# EAGLE schematic MSP430_REV1_5_21_19_NEW1 (EAGLE 9.3.1)

## Sheet 1 of 2
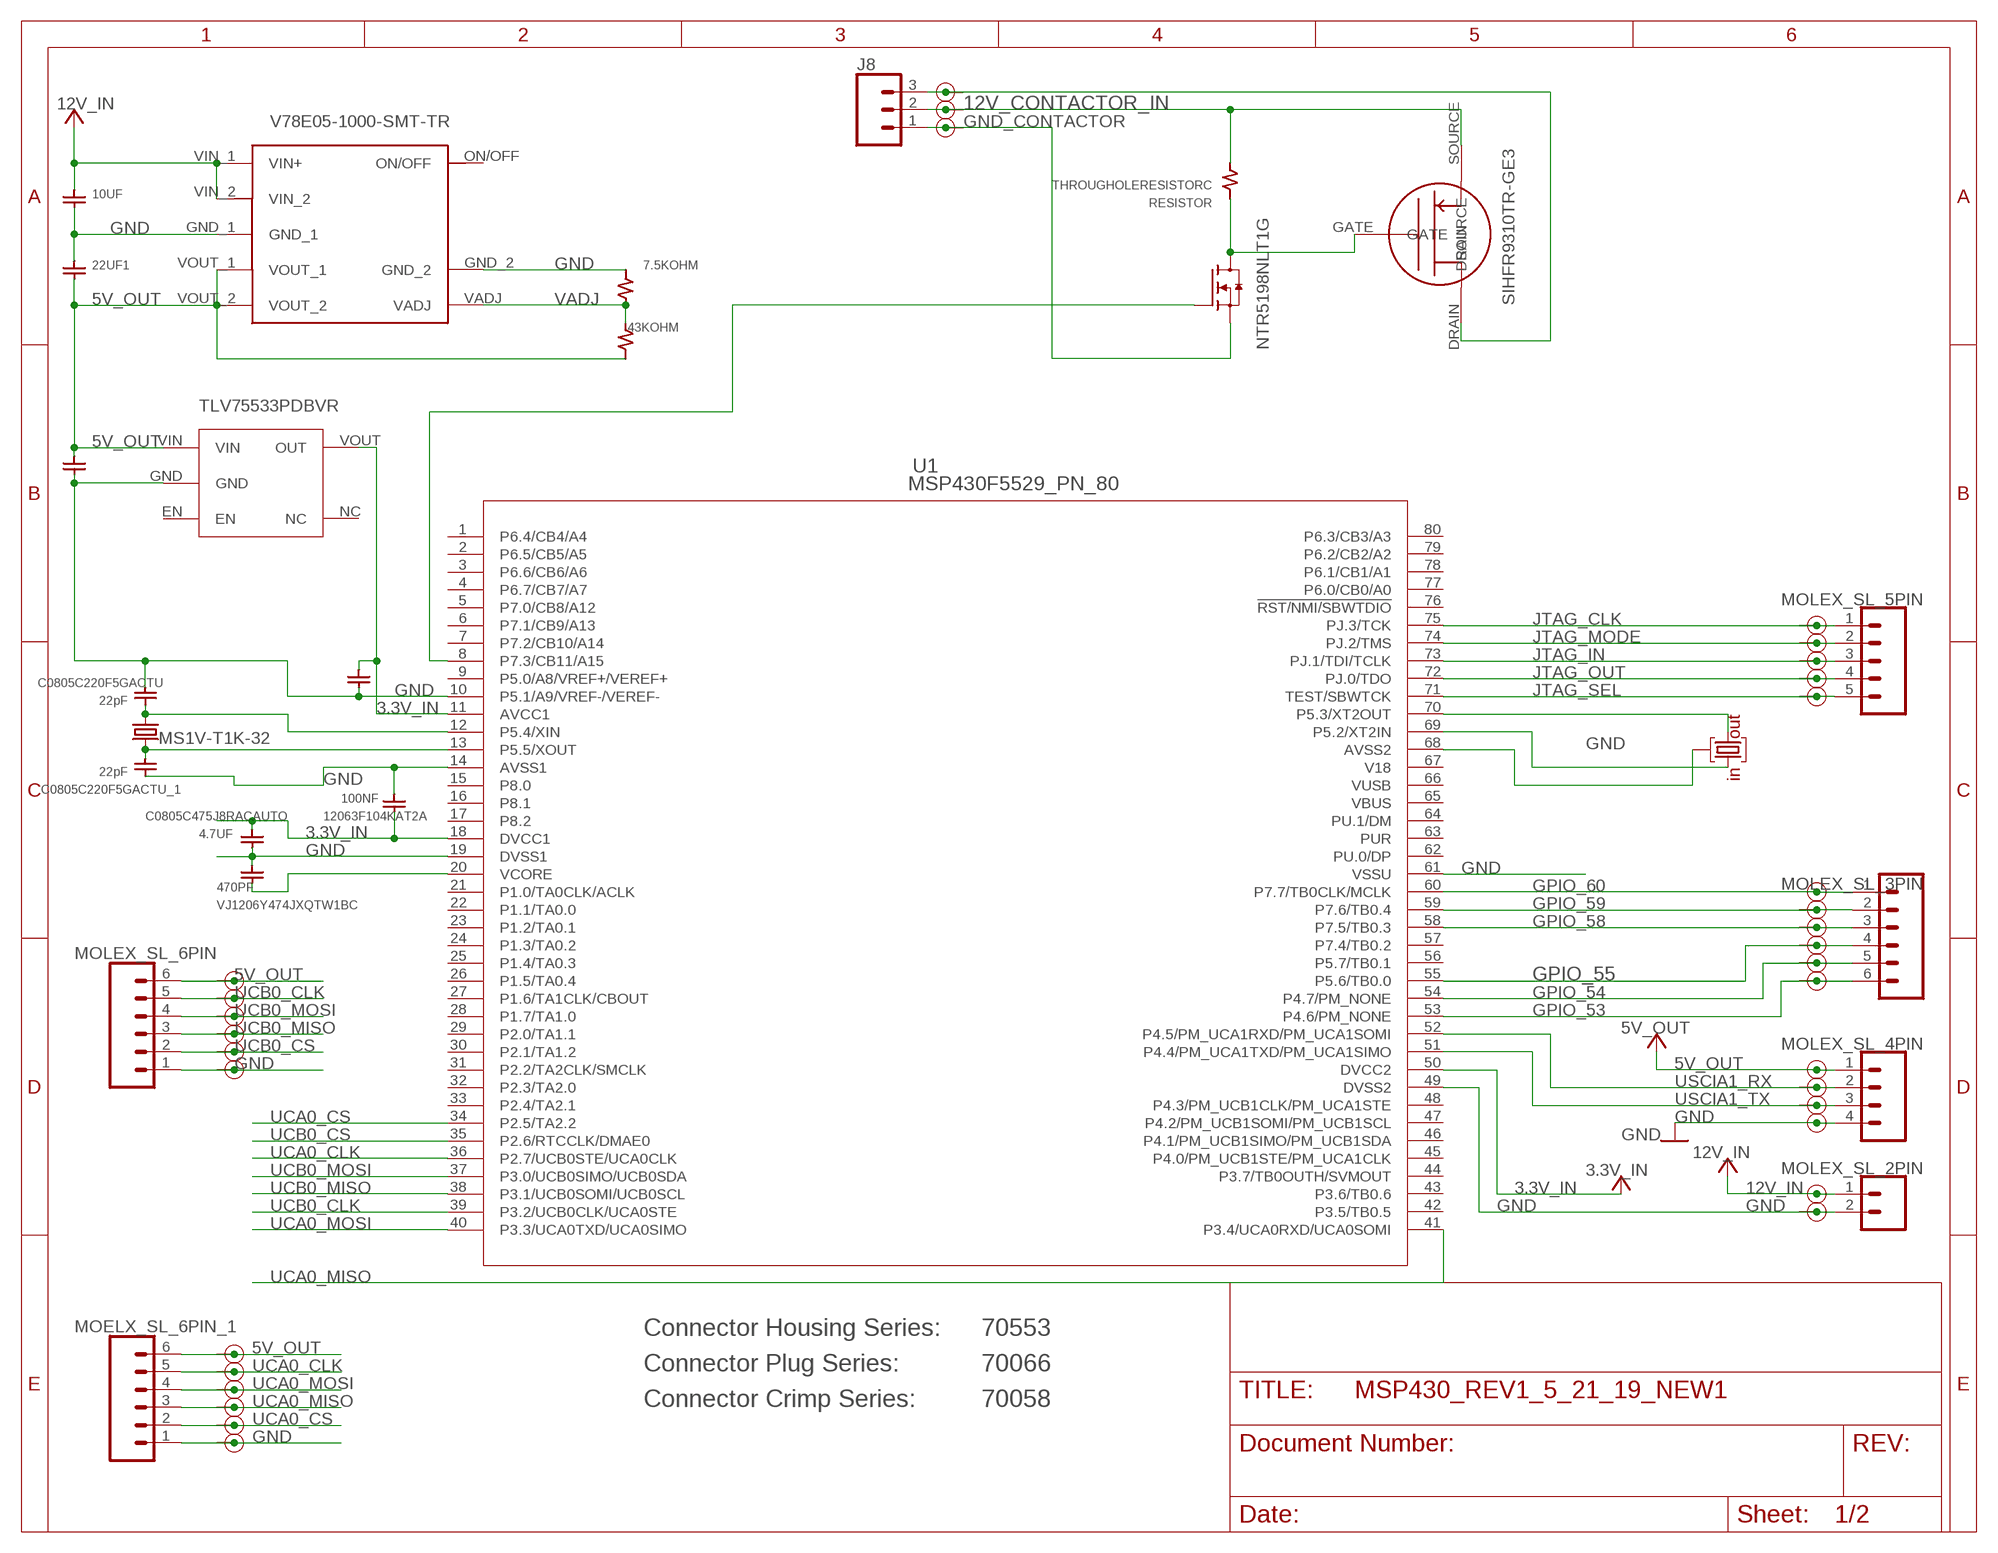
[diagram p0: schematic, sheet 1]

### Parts
4.7UF  C0805C475J8RACAUTO  [C0805C475J8RACAUTO]
7.5KOHM  RC2512FK-077K5L  [RC2512FK-077K5L]
10UF  GRT31CR61H106KE01L  [GRT31CR61H106KE01L]
22UF1  GRT31CC81C226KE01L  [GRT31CC81C226KE01L]
43KOHM  CRCW121043K0FKEAHP  [CRCW121043K0FKEAHP]
100NF  12063F104KAT2A  [12063F104KAT2A]
470PF  VJ1206Y474JXQTW1BC  [VJ1206Y474JXQTW1BC]
C0805C220F5GACTU  22pF  C0805C220F5GACTUC0805C220F5GACTU  [C0805C220F5GACTU]
C0805C220F5GACTU_1  22pF  C0805C220F5GACTUC0805C220F5GACTU  [C0805C220F5GACTU]
J8  CONN_03  [1X03]
MOELX_SL_6PIN_1  CONN_06SILK_FEMALE_PTH  [1X06]
MOLEX_SL_2PIN  CONN_02  [1X02]
MOLEX_SL_3PIN  CONN_06SILK_FEMALE_PTH  [1X06]
MOLEX_SL_4PIN  CONN_04  [1X04]
MOLEX_SL_5PIN  CONN_05  [1X05]
MOLEX_SL_6PIN  CONN_06SILK_FEMALE_PTH  [1X06]
RESISTOR  THROUGHOLERESISTORC  THROUGHOLERESISTORCMF6023K000DHR6  [THROUGHHOLERESISTOR]
U1  MSP430F5529_PN_80  [PN80]
U$1  MS1V-T1K-32  [MS1V-T1K]
U$2  CSTCR4M00G53U-R0  [CSTCR4M00G53U-R0]
U$3  V78E05-SMT-TR  [V78E05-1000-SMT-TR]
U$4  NTR5198NLT1G  [NTR5198NLT1G]
U$5  PMOS  [SIHFR9310TR-GE3]
U$6  TLV75533PDBVR  [TLV75533PDBVR]
U$7  C0805C105J4RECTU  [C0805C105J4RECTU]
U$8  C0805C105J4RECTU  [C0805C105J4RECTU]
U$10  HEADER_PIN_2.15/1.0  [2,15/1,0]
U$11  HEADER_PIN_2.15/1.0  [2,15/1,0]
U$12  HEADER_PIN_2.15/1.0  [2,15/1,0]
U$13  HEADER_PIN_2.15/1.0  [2,15/1,0]
U$14  HEADER_PIN_2.15/1.0  [2,15/1,0]
U$15  HEADER_PIN_2.15/1.0  [2,15/1,0]
U$16  HEADER_PIN_2.15/1.0  [2,15/1,0]
U$17  HEADER_PIN_2.15/1.0  [2,15/1,0]
U$18  HEADER_PIN_2.15/1.0  [2,15/1,0]
U$19  HEADER_PIN_2.15/1.0  [2,15/1,0]
U$20  HEADER_PIN_2.15/1.0  [2,15/1,0]
U$21  HEADER_PIN_2.15/1.0  [2,15/1,0]
U$22  HEADER_PIN_2.15/1.0  [2,15/1,0]
U$23  HEADER_PIN_2.15/1.0  [2,15/1,0]
U$24  HEADER_PIN_2.15/1.0  [2,15/1,0]
U$25  HEADER_PIN_2.15/1.0  [2,15/1,0]
U$26  HEADER_PIN_2.15/1.0  [2,15/1,0]
U$27  HEADER_PIN_2.15/1.0  [2,15/1,0]
U$28  HEADER_PIN_2.15/1.0  [2,15/1,0]
U$29  HEADER_PIN_2.15/1.0  [2,15/1,0]
U$30  HEADER_PIN_2.15/1.0  [2,15/1,0]
U$31  HEADER_PIN_2.15/1.0  [2,15/1,0]
U$32  HEADER_PIN_2.15/1.0  [2,15/1,0]
U$33  HEADER_PIN_2.15/1.0  [2,15/1,0]
U$34  HEADER_PIN_2.15/1.0  [2,15/1,0]
U$35  HEADER_PIN_2.15/1.0  [2,15/1,0]
U$36  HEADER_PIN_2.15/1.0  [2,15/1,0]
U$37  HEADER_PIN_2.15/1.0  [2,15/1,0]
U$38  HEADER_PIN_2.15/1.0  [2,15/1,0]
U$39  HEADER_PIN_2.15/1.0  [2,15/1,0]
U$40  HEADER_PIN_2.15/1.0  [2,15/1,0]
U$41  HEADER_PIN_2.15/1.0  [2,15/1,0]

### Nets
3.3V_IN: 4.7UF.2 100NF.1 U1.11(AVCC1) U1.18(DVCC1) U1.50(DVCC2) U$6.VOUT(OUT) U$8.2
5V_OUT: 22UF1.1 43KOHM.2 MOELX_SL_6PIN_1.6 MOLEX_SL_4PIN.1 MOLEX_SL_6PIN.6 U$3.VOUT_1 U$3.VOUT_2 U$6.VIN U$7.2 U$11.1 U$17.1 U$27.1
12V_CONTACTOR_IN: J8.2 RESISTOR.1 U$5.SOURCE U$40.1
12V_IN: 10UF.2 MOLEX_SL_2PIN.1 U$3.VIN_1(VIN+) U$3.VIN_2 U$23.1
GND: 4.7UF.1 7.5KOHM.2 10UF.1 22UF1.2 100NF.2 470PF.2 C0805C220F5GACTU.1 C0805C220F5GACTU_1.2 MOELX_SL_6PIN_1.1 MOLEX_SL_2PIN.2 MOLEX_SL_4PIN.4 MOLEX_SL_6PIN.1 U1.10(P5.1/A9/VREF-/VEREF-) U1.14(AVSS1) U1.19(DVSS1) U1.49(DVSS2) U1.61(VSSU) U1.68(AVSS2) U$2.GND U$3.GND_1 U$3.GND_2 U$6.GND U$7.1 U$8.1 U$10.1 U$16.1 U$22.1 U$24.1 ; also sheet 2
GND_CONTACTOR: J8.1 U$4.SOURCE U$41.1
GPIO_53: MOLEX_SL_3PIN.6 U1.53(P4.6/PM_NONE) U$28.1
GPIO_54: MOLEX_SL_3PIN.5 U1.54(P4.7/PM_NONE) U$29.1
GPIO_55: MOLEX_SL_3PIN.4 U1.55(P5.6/TB0.0) U$30.1
GPIO_58: MOLEX_SL_3PIN.3 U1.58(P7.5/TB0.3) U$31.1
GPIO_59: MOLEX_SL_3PIN.2 U1.59(P7.6/TB0.4) U$32.1
GPIO_60: MOLEX_SL_3PIN.1 U1.60(P7.7/TB0CLK/MCLK) U$33.1
JTAG_CLK: MOLEX_SL_5PIN.1 U1.75(PJ.3/TCK) U$38.1
JTAG_IN: MOLEX_SL_5PIN.3 U1.73(PJ.1/TDI/TCLK) U$36.1
JTAG_MODE: MOLEX_SL_5PIN.2 U1.74(PJ.2/TMS) U$37.1
JTAG_OUT: MOLEX_SL_5PIN.4 U1.72(PJ.0/TDO) U$35.1
JTAG_SEL: MOLEX_SL_5PIN.5 U1.71(TEST/SBWTCK) U$34.1
N$1: 470PF.1 U1.20(VCORE)
N$2: J8.3 U$5.DRAIN U$39.1
N$12: U1.69(P5.2/XT2IN) U$2.IN
N$13: U1.70(P5.3/XT2OUT) U$2.OUT
N$19: C0805C220F5GACTU.2 U1.12(P5.4/XIN) U$1.P$2
N$20: C0805C220F5GACTU_1.1 U1.13(P5.5/XOUT) U$1.P$3
N$30: RESISTOR.2 U$4.DRAIN U$5.GATE
N$31: U1.8(P7.3/CB11/A15) U$4.GATE
UCA0_CLK: MOELX_SL_6PIN_1.5 U1.36(P2.7/UCB0STE/UCA0CLK) U$18.1
UCA0_CS: MOELX_SL_6PIN_1.2 U1.34(P2.5/TA2.2) U$21.1
UCA0_MISO: MOELX_SL_6PIN_1.3 U1.41(P3.4/UCA0RXD/UCA0SOMI) U$20.1
UCA0_MOSI: MOELX_SL_6PIN_1.4 U1.40(P3.3/UCA0TXD/UCA0SIMO) U$19.1
UCB0_CLK: MOLEX_SL_6PIN.5 U1.39(P3.2/UCB0CLK/UCA0STE) U$12.1
UCB0_CS: MOLEX_SL_6PIN.2 U1.35(P2.6/RTCCLK/DMAE0) U$15.1
UCB0_MISO: MOLEX_SL_6PIN.3 U1.38(P3.1/UCB0SOMI/UCB0SCL) U$14.1
UCB0_MOSI: MOLEX_SL_6PIN.4 U1.37(P3.0/UCB0SIMO/UCB0SDA) U$13.1
USCIA1_RX: MOLEX_SL_4PIN.2 U1.52(P4.5/PM_UCA1RXD/PM_UCA1SOMI) U$26.1
USCIA1_TX: MOLEX_SL_4PIN.3 U1.51(P4.4/PM_UCA1TXD/PM_UCA1SIMO) U$25.1
VADJ: 7.5KOHM.1 43KOHM.1 U$3.VADJ
Unconnected: U1.1(P6.4/CB4/A4) U1.2(P6.5/CB5/A5) U1.3(P6.6/CB6/A6) U1.4(P6.7/CB7/A7) U1.5(P7.0/CB8/A12) U1.6(P7.1/CB9/A13) U1.7(P7.2/CB10/A14) U1.9(P5.0/A8/VREF+/VEREF+) U1.15(P8.0) U1.16(P8.1) U1.17(P8.2) U1.21(P1.0/TA0CLK/ACLK) U1.22(P1.1/TA0.0) U1.23(P1.2/TA0.1) U1.24(P1.3/TA0.2) U1.25(P1.4/TA0.3) U1.26(P1.5/TA0.4) U1.27(P1.6/TA1CLK/CBOUT) U1.28(P1.7/TA1.0) U1.29(P2.0/TA1.1) U1.30(P2.1/TA1.2) U1.31(P2.2/TA2CLK/SMCLK) U1.32(P2.3/TA2.0) U1.33(P2.4/TA2.1) U1.42(P3.5/TB0.5) U1.43(P3.6/TB0.6) U1.44(P3.7/TB0OUTH/SVMOUT) U1.45(P4.0/PM_UCB1STE/PM_UCA1CLK) U1.46(P4.1/PM_UCB1SIMO/PM_UCB1SDA) U1.47(P4.2/PM_UCB1SOMI/PM_UCB1SCL) U1.48(P4.3/PM_UCB1CLK/PM_UCA1STE) U1.56(P5.7/TB0.1) U1.57(P7.4/TB0.2) U1.62(PU.0/DP) U1.63(PUR) U1.64(PU.1/DM) U1.76(!RST/NMI/SBWTDIO) U1.77(P6.0/CB0/A0) U1.78(P6.1/CB1/A1) U1.79(P6.2/CB2/A2) U1.80(P6.3/CB3/A3) U$3.ON/OFF U$6.EN U$6.NC

### Notes on the sheet
- Connector Housing Series: | 70553
- Connector Plug Series: | 70066
- Connector Crimp Series: | 70058

## Sheet 2 of 2
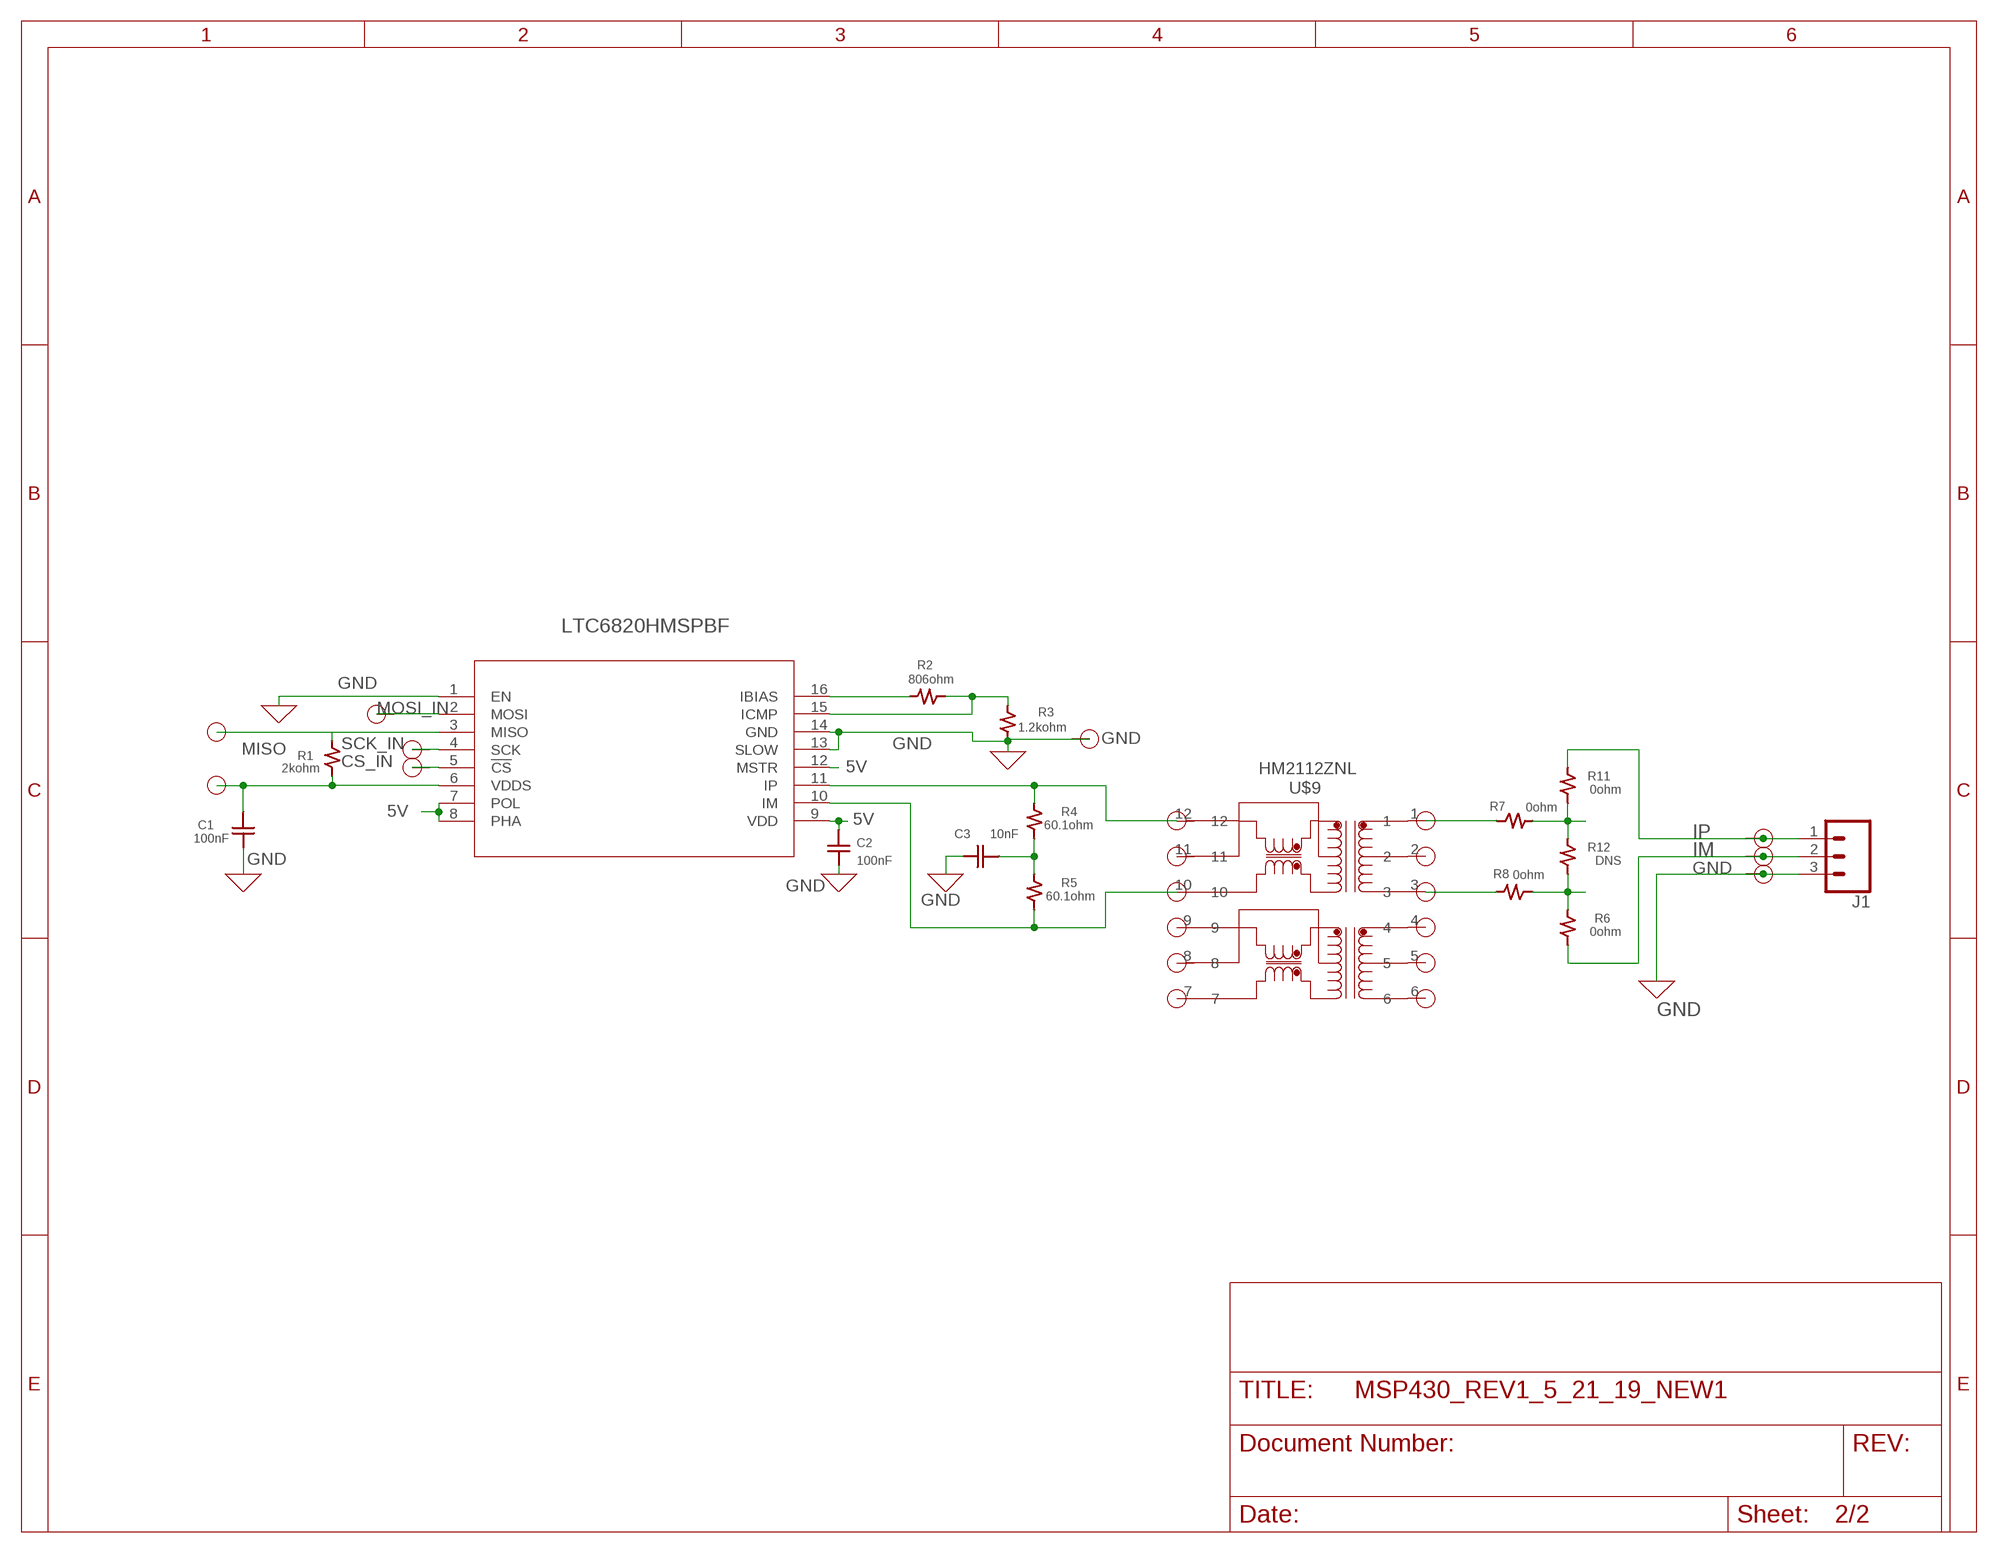
[diagram p1: schematic, sheet 2]

### Parts
C1  100nF  0805_CAPACITOR  [0805_CAPACITOR]
C2  100nF  0805_CAPACITOR  [0805_CAPACITOR]
C3  10nF  0805_CAPACITOR  [0805_CAPACITOR]
CS  HEADER_PIN_2.15/1.0  [2,15/1,0]
GND  HEADER_PIN_2.15/1.0  [2,15/1,0]
J1  CONN_03  [1X03]
MISO  HEADER_PIN_2.15/1.0  [2,15/1,0]
MOSI  HEADER_PIN_2.15/1.0  [2,15/1,0]
R1  2kohm  0805_RESISTOR  [0805_RESISTOR]
R2  806ohm  0805_RESISTOR  [0805_RESISTOR]
R3  1.2kohm  0805_RESISTOR  [0805_RESISTOR]
R4  60.1ohm  0805_RESISTOR  [0805_RESISTOR]
R5  60.1ohm  0805_RESISTOR  [0805_RESISTOR]
R6  0ohm  0805_RESISTOR  [0805_RESISTOR]
R7  0ohm  0805_RESISTOR  [0805_RESISTOR]
R8  0ohm  0805_RESISTOR  [0805_RESISTOR]
R11  0ohm  0805_RESISTOR  [0805_RESISTOR]
R12  DNS  0805_RESISTOR  [0805_RESISTOR]
SCK  HEADER_PIN_2.15/1.0  [2,15/1,0]
U2  LTC6820HMSPBF  [MSOP-16_MS]
U$9  HM2112ZNL  [HM2112ZNL_12SMT]
U$42  HEADER_PIN_2.15/1.0  [2,15/1,0]
U$43  HEADER_PIN_2.15/1.0  [2,15/1,0]
U$44  HEADER_PIN_2.15/1.0  [2,15/1,0]
VDDS  HEADER_PIN_2.15/1.0  [2,15/1,0]

### Nets
5V: C1.P$2 C2.P$2 R1.P$2 U2.6(VDDS) U2.7(POL) U2.8(PHA) U2.9(VDD) U2.12(MSTR) VDDS.1
CS_IN: CS.1 U2.5(!CS)
GND: C1.P$1 C2.P$1 C3.P$1 GND.1 J1.3 R3.P$2 U2.1(EN) U2.13(SLOW) U2.14(GND) U$44.1 ; also sheet 1
IBIAS: R2.P$1 U2.16(IBIAS)
ICMP: R2.P$2 R3.P$1 U2.15(ICMP)
IM: J1.2 R5.P$2 R6.P$2 U2.10(IM) U$9.10 U$43.1
IP: J1.1 R4.P$1 R11.P$1 U2.11(IP) U$9.12 U$42.1
MISO_IN: MISO.1 R1.P$1 U2.3(MISO)
MOSI_IN: MOSI.1 U2.2(MOSI)
N$3: C3.P$2 R4.P$2 R5.P$1
N$11: R8.P$1 U$9.3
N$21: R7.P$2 U$9.1
N$40: R6.P$1 R8.P$2 R12.P$2
N$41: R7.P$1 R11.P$2 R12.P$1
SCK_IN: SCK.1 U2.4(SCK)
Unconnected: U$9.2 U$9.4 U$9.5 U$9.6 U$9.7 U$9.8 U$9.9 U$9.11

## Power pins joined to a net without a drawn wire
V18: U1.67(V18)
VBUS: U1.65(VBUS)
VUSB: U1.66(VUSB)

## Library data of the parts
4.7UF = Library_Capstone:C0805C475J8RACAUTO
7.5KOHM = Library_Capstone:RC2512FK-077K5L
10UF = Library_Capstone:GRT31CR61H106KE01L
22UF1 = Library_Capstone:GRT31CC81C226KE01L
43KOHM = Library_Capstone:CRCW121043K0FKEAHP
100NF = Library_Capstone:12063F104KAT2A
470PF = Library_Capstone:VJ1206Y474JXQTW1BC
C1-C3 = Library_Capstone:0805_CAPACITOR; MPN: MC0805B104K160CT; OC_NEWARK: 06R3738
C0805C220F5GACTU C0805C220F5GACTU_1 = Library_Capstone:C0805C220F5GACTU
CS GND MISO MOSI SCK U$10-U$44 VDDS = Library_Capstone:HEADER_PIN_2.15/1.0
J1 J8 = SparkFun-Connectors:CONN_03: Multi connection point. Often used as Generic Header-pin footprint for 0.1 inch spaced/style header connections On any of the 0.1 inch spaced packages, you can populate with these: Break Away Headers - Straight <https://www.sparkfun.com/products/116> (PRT-00116) Break Away Male Headers - Right Angle <https://www.sparkfun.com/products/553> (PRT-00553) Female Headers <https://www.sparkfun.com/products/115> (PRT-00115) Break Away Headers - Machine Pin <https://www.sparkfun.com/products/117> (PRT-00117) Break Away Female Headers - Swiss Machine Pin <https://www.sparkfun.com/products/743> (PRT-00743) Stackable Header - 3 Pin (Female, 0.1") <https://www.sparkfun.com/products/13875> (PRT-13875) For SCREWTERMINALS and SPRING TERMINALS visit here: Screw Terimnals on SparkFun.com <https://www.sparkfun.com/search/results?term=Screw+Terminals> (5mm/3.5mm/2.54mm spacing) This device is also useful as a general connection point to wire up your design to another part of your project. Our various solder wires solder well into these plated through hole pads. Hook-Up Wire - Assortment (Stranded, 22 AWG) <https://www.sparkfun.com/products/11375> (PRT-11375) Hook-Up Wire - Assortment (Solid Core, 22 AWG) <https://www.sparkfun.com/products/11367> (PRT-11367) View the entire wire category on our website here <https://www.sparkfun.com/categories/141> Special notes: Molex polarized connector foot print use with SKU : PRT-08232 with associated crimp pins and housings.
MOELX_SL_6PIN_1 MOLEX_SL_3PIN MOLEX_SL_6PIN = SparkFun-Connectors:CONN_06: Multi connection point. Often used as Generic Header-pin footprint for 0.1 inch spaced/style header connections On any of the 0.1 inch spaced packages, you can populate with these: Break Away Headers - Straight <https://www.sparkfun.com/products/116> (PRT-00116) Break Away Male Headers - Right Angle <https://www.sparkfun.com/products/553> (PRT-00553) Female Headers <https://www.sparkfun.com/products/115> (PRT-00115) Break Away Headers - Machine Pin <https://www.sparkfun.com/products/117> (PRT-00117) Break Away Female Headers - Swiss Machine Pin <https://www.sparkfun.com/products/743> (PRT-00743) Arduino Stackable Header - 6 Pin <https://www.sparkfun.com/products/9280> (PRT-09280) For SCREWTERMINALS and SPRING TERMINALS visit here: Screw Terimnals on SparkFun.com <https://www.sparkfun.com/search/results?term=Screw+Terminals> (5mm/3.5mm/2.54mm spacing) This device is also useful as a general connection point to wire up your design to another part of your project. Our various solder wires solder well into these plated through hole pads. Hook-Up Wire - Assortment (Stranded, 22 AWG) <https://www.sparkfun.com/products/11375> (PRT-11375) Hook-Up Wire - Assortment (Solid Core, 22 AWG) <https://www.sparkfun.com/products/11367> (PRT-11367) View the entire wire category on our website here <https://www.sparkfun.com/categories/141>; PROD_ID: CONN-08437
MOLEX_SL_2PIN = SparkFun-Connectors:CONN_02: Multi connection point. Often used as Generic Header-pin footprint for 0.1 inch spaced/style header connections On any of the 0.1 inch spaced packages, you can populate with these: Break Away Headers - Straight <https://www.sparkfun.com/products/116> (PRT-00116) Break Away Male Headers - Right Angle <https://www.sparkfun.com/products/553> (PRT-00553) Female Headers <https://www.sparkfun.com/products/115> (PRT-00115) Break Away Headers - Machine Pin <https://www.sparkfun.com/products/117> (PRT-00117) Break Away Female Headers - Swiss Machine Pin <https://www.sparkfun.com/products/743> (PRT-00743) For SCREWTERMINALS and SPRING TERMINALS visit here: Screw Terimnals on SparkFun.com <https://www.sparkfun.com/search/results?term=Screw+Terminals> (5mm/3.5mm/2.54mm spacing) This device is also useful as a general connection point to wire up your design to another part of your project. Our various solder wires solder well into these plated through hole pads. Hook-Up Wire - Assortment (Stranded, 22 AWG) <https://www.sparkfun.com/products/11375> (PRT-11375) Hook-Up Wire - Assortment (Solid Core, 22 AWG) <https://www.sparkfun.com/products/11367> (PRT-11367) View the entire wire category on our website here <https://www.sparkfun.com/categories/141> Special notes: Molex polarized connector foot print use with: PRT-08233 with associated crimp pins and housings. 2.54_SCREWTERM for use with PRT-10571. 3.5mm Screw Terminal footprints for PRT-08084 5mm Screw Terminal footprints for use with PRT-08432
MOLEX_SL_4PIN = SparkFun-Connectors:CONN_04: Multi connection point. Often used as Generic Header-pin footprint for 0.1 inch spaced/style header connections On any of the 0.1 inch spaced packages, you can populate with these: Break Away Headers - Straight <https://www.sparkfun.com/products/116> (PRT-00116) Break Away Male Headers - Right Angle <https://www.sparkfun.com/products/553> (PRT-00553) Female Headers <https://www.sparkfun.com/products/115> (PRT-00115) Break Away Headers - Machine Pin <https://www.sparkfun.com/products/117> (PRT-00117) Break Away Female Headers - Swiss Machine Pin <https://www.sparkfun.com/products/743> (PRT-00743) For SCREWTERMINALS and SPRING TERMINALS visit here: Screw Terimnals on SparkFun.com <https://www.sparkfun.com/search/results?term=Screw+Terminals> (5mm/3.5mm/2.54mm spacing) This device is also useful as a general connection point to wire up your design to another part of your project. Our various solder wires solder well into these plated through hole pads. Hook-Up Wire - Assortment (Stranded, 22 AWG) <https://www.sparkfun.com/products/11375> (PRT-11375) Hook-Up Wire - Assortment (Solid Core, 22 AWG) <https://www.sparkfun.com/products/11367> (PRT-11367) View the entire wire category on our website here <https://www.sparkfun.com/categories/141> Special notes: Molex polarized connector foot print use with SKU : PRT-08231 with associated crimp pins and housings. 1MM SMD Version SKU: PRT-10208; PROD_ID: CONN-09696
MOLEX_SL_5PIN = SparkFun-Connectors:CONN_05: Multi connection point. Often used as Generic Header-pin footprint for 0.1 inch spaced/style header connections On any of the 0.1 inch spaced packages, you can populate with these: Break Away Headers - Straight <https://www.sparkfun.com/products/116> (PRT-00116) Break Away Male Headers - Right Angle <https://www.sparkfun.com/products/553> (PRT-00553) Female Headers <https://www.sparkfun.com/products/115> (PRT-00115) Break Away Headers - Machine Pin <https://www.sparkfun.com/products/117> (PRT-00117) Break Away Female Headers - Swiss Machine Pin <https://www.sparkfun.com/products/743> (PRT-00743) For SCREWTERMINALS and SPRING TERMINALS visit here: Screw Terimnals on SparkFun.com <https://www.sparkfun.com/search/results?term=Screw+Terminals> (5mm/3.5mm/2.54mm spacing) This device is also useful as a general connection point to wire up your design to another part of your project. Our various solder wires solder well into these plated through hole pads. Hook-Up Wire - Assortment (Stranded, 22 AWG) <https://www.sparkfun.com/products/11375> (PRT-11375) Hook-Up Wire - Assortment (Solid Core, 22 AWG) <https://www.sparkfun.com/products/11367> (PRT-11367) View the entire wire category on our website here <https://www.sparkfun.com/categories/141> Special notes: Molex polarized connector foot print use with SKU : PRT-08231 with associated crimp pins and housings. 1MM SMD Version SKU: PRT-10208
R1 = Library_Capstone:0805_RESISTOR; MPN: ERJ-6ENF2001V; OC_NEWARK: 65T8715
R2 = Library_Capstone:0805_RESISTOR; MF: VISHAY/DALE; MPN: CRCW0805806RFKEA; OC_NEWARK: 53K0501
R3 = Library_Capstone:0805_RESISTOR; MPN: MC0805S8F1201T5E; OC_NEWARK: 04P0558
R4-R8 R11 R12 = Library_Capstone:0805_RESISTOR; MF: BOURNS, INC.; MPN: CR0805-FX-1200GLF; OC_NEWARK: 32K2808
RESISTOR = Library_Capstone:THROUGHOLERESISTOR
U1 = MSP430f5529:MSP430F5529_PN_80; MANUFACTURER_PART_NUMBER: MSP430F5529_PN_80; VENDOR: Texas Instruments
U2 = 6820_MSOP-16_MS-M:LTC6820HMSPBF; MANUFACTURER_PART_NUMBER: LTC6820HMS#PBF; OC_NEWARK: unknown; VENDOR: Linear Technology
U$1 = Library_Capstone:MS1V-T1K-32
U$2 = Library_Capstone:CSTCR4M00G53U-R0
U$3 = Library_Capstone:V78E05-SMT-TR
U$4 = Library_Capstone:NTR5198NLT1G
U$5 = Library_Capstone:PMOS
U$6 = Library_Capstone:TLV75533PDBVR
U$7 U$8 = Library_Capstone:C0805C105J4RECTU
U$9 = Library_Capstone:HM2112ZNL